# EAGLE design COsensor03 (EAGLE 5.10)
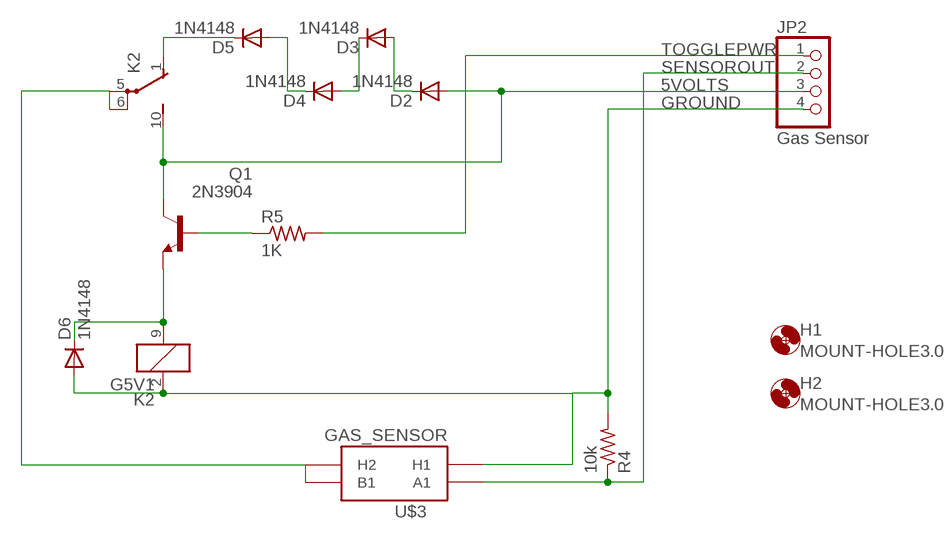
[diagram p0: schematic, sheet 1]

## Parts
D2  1N4148  1N4148DO35-7  [DO35-7]
D3  1N4148  1N4148DO35-7  [DO35-7]
D4  1N4148  1N4148DO35-7  [DO35-7]
D5  1N4148  1N4148DO35-7  [DO35-7]
D6  1N4148  1N4148DO35-7  [DO35-7]
H1  MOUNT-HOLE3.0  [3,0]
H2  MOUNT-HOLE3.0  [3,0]
JP2  Gas Sensor  PINHD-1X4  [1X04]
K2  G5V1  [G5V1]
Q1  2N3904  [TO92]
R4  10k  R-US_0204/7  [0204/7]
R5  1K  R-US_0613/5V  [P0613V]
U$3  GAS_SENSOR  [MQ-3]

## Nets
5VOLTS: D2.A JP2.3 K2.10(2:S) Q1.1(C)
GROUND: D6.A JP2.4 K2.2 R4.2 U$3.HA(H1)
N$7: D2.C D3.A
N$8: K2.5(2:P) K2.6(2:P) U$3.B1 U$3.HB(H2)
N$9: D3.C D4.A
N$10: D4.C D5.A
N$11: D5.C K2.1(2:O)
N$16: D6.C K2.9 Q1.3(E)
N$18: Q1.2(B) R5.1
SENSOROUT: JP2.2 R4.1 U$3.A1
TOGGLEPWR: JP2.1 R5.2

## Library data of the parts
D2-D6 = diode:1N4148: DIODE high speed (Philips)
H1 H2 = holes:MOUNT-HOLE: MOUNTING HOLE with drill center marker
JP2 = pinhead:PINHD-1X4: PIN HEADER
K2 = relay:G5V1: RELAY 1 x switch, 0.5 A/125 V AC, 1 A/24 V DC , Omron
Q1 = transistor-npn:2N3904: NPN Transistor
R4 = rcl:R-US_: RESISTOR, American symbol
R5 = resistor:R-US_: RESISTOR, American symbol
U$3 = SparkFun 2:GAS_SENSOR: MQ-3 Gas Sensor. FP not tested. Part#

## Board
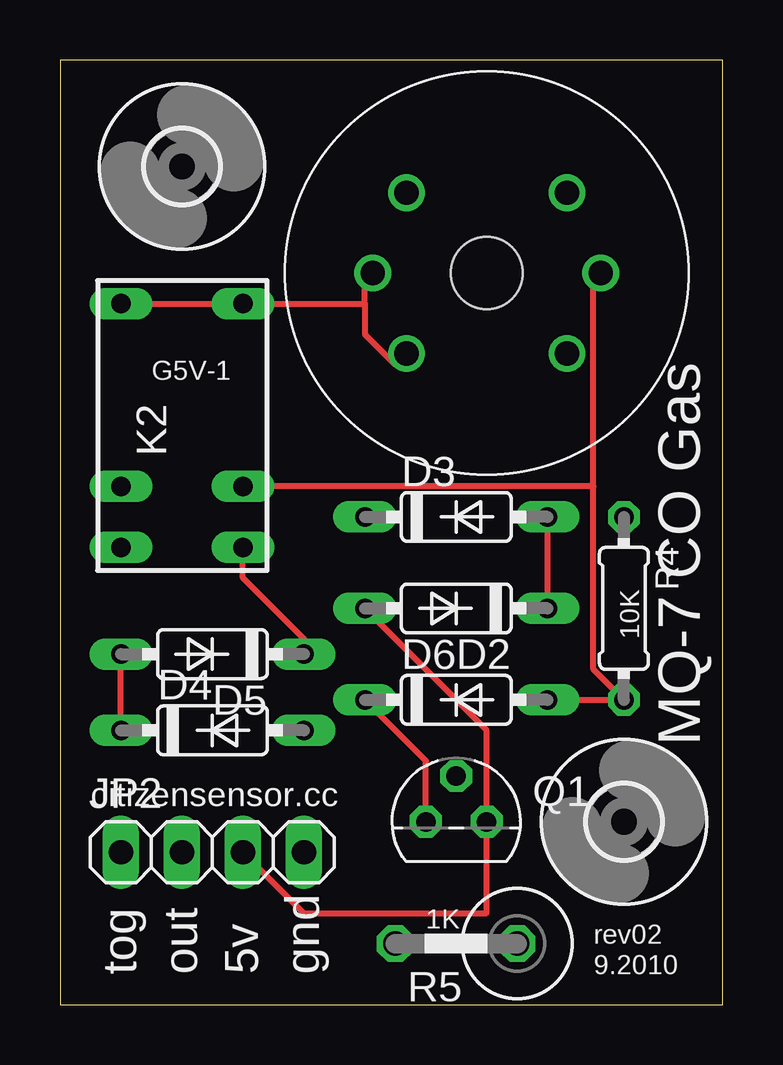
[diagram p1: board, top side]
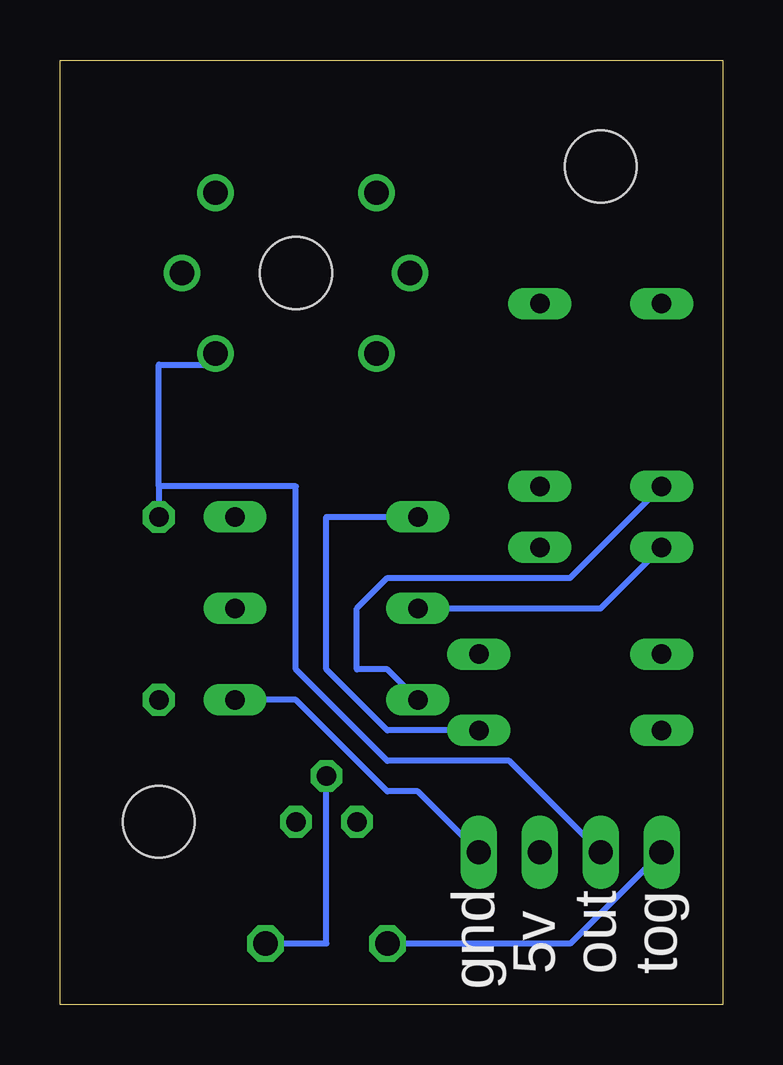
[diagram p2: board, bottom side, seen from below]

Size 27.61 x 39.36 mm. Coordinates in mm from the lower left corner, seen from the top.
Outline: 0,0 27.61,0 27.61,39.36 0,39.36 0,0
Copper layers (1*16): Top 0.035mm / dielectric 1.5mm / Bottom 0.035mm
Design rules "default": minimum track width 10mil, minimum drill 24mil, track to track 8mil, track to pad 8mil, pad to pad 8mil, via to via 8mil, smd to smd 8mil, copper to edge 40mil, drill to drill 8mil, minimum pad ring 10mil, minimum via ring 8mil, stop-mask expansion 4mil, vias tented up to drill 0mil, thermal gap 10mil

### Footprints (pad centres in the part's own frame; a part is rotated, then mirrored left to right if it is on the bottom)
DO35-7 = drill 0.813 long: A 3.81,0; C -3.81,0
3,0 = hole 3: 0,0
1X04 = drill 1.016 long: 1 -3.81,0; 2 -1.27,0; 3 1.27,0; 4 3.81,0
G5V1 = drill 0.813 long: 1 -5.08,-2.54; 2 -2.54,-2.54; 5 5.08,-2.54; 6 5.08,2.54; 9 -2.54,2.54; 10 -5.08,2.54
TO92 = drill 0.813 octagon: 1 1.27,0; 2 0,1.905; 3 -1.27,0
0204/7 = drill 0.813 octagon: 1 -3.81,0; 2 3.81,0
P0613V = drill 1.016 octagon: 1 -2.54,0; 2 2.54,0
MQ-3 = drill 1.016 round: A1 -3.35,3.35; A2 -3.35,-3.35; B1 3.35,3.35; B2 3.35,-3.35; HA -4.75,0; HB 4.75,0 | hole 3: 0,0

### Placement (x,y rotation side)
D2  16.51,16.51 180 top
D3  16.51,20.32 0 top
D4  6.35,11.43 0 top
D5  6.35,14.61 180 top
D6  16.51,12.7 0 top
H1  5.08,34.92 0 top
H2  23.5,7.62 0 top
JP2  6.35,6.35 0 top
K2  5.08,24.13 90 top
Q1  16.51,7.62 0 top
R4  23.5,16.51 270 top
R5  16.51,2.54 180 top
U$3  17.78,30.48 180 top

### Tracks (layer width: path | path; a pad name or v marks a point on that pad's centre or on a via)
5VOLTS
  Top 0.254: D2.A 17.78,11.43 Q1.1 17.78,3.81 10.16,3.81 JP2.3
  Bottom 0.254: K2.10 5.08,16.51 D2.A
GROUND
  Top 0.254: D6.A R4.2 22.23,13.97 22.23,21.59 | 22.23,21.59 K2.2 | 22.23,21.59 22.23,30.48 U$3.HA
  Bottom 0.254: JP2.4 12.7,8.89 13.97,8.89 17.78,12.7 D6.A
N$7
  Top 0.254: D2.C D3.A
N$8
  Top 0.254: K2.6 K2.5 12.7,29.21 | 12.7,29.21 12.7,30.48 U$3.HB | 12.7,29.21 12.7,27.94 13.97,26.67 U$3.B1
N$9
  Bottom 0.254: D4.A 13.97,11.43 16.51,13.97 16.51,20.32 D3.C
N$10
  Top 0.254: D4.C D5.A
N$11
  Top 0.254: K2.1 7.62,17.78 10.16,15.24 D5.C
N$16
  Top 0.254: D6.C 15.24,10.16 Q1.3
  Bottom 0.254: K2.9 6.35,17.78 13.97,17.78 15.24,16.51 15.24,13.97 13.97,13.97 D6.C
N$18
  Bottom 0.254: R5.1 16.51,2.54 Q1.2
SENSOROUT
  Bottom 0.254: 23.5,21.59 23.5,26.67 21.59,26.67 U$3.A1 | 23.5,21.59 R4.1 | JP2.2 8.89,10.16 13.97,10.16 17.78,13.97 17.78,21.59 23.5,21.59
TOGGLEPWR
  Bottom 0.254: JP2.1 6.35,2.54 R5.2

### Text on the board
_tsilk: G5V-1 | 10K | MQ-7 CO Gas | citizensensor.cc | 1K | rev02 | tog | out | 5v | gnd | 9.2010
_bsilk: tog | out | 5v | gnd